# EAGLE schematic final (EAGLE 9.6.2)
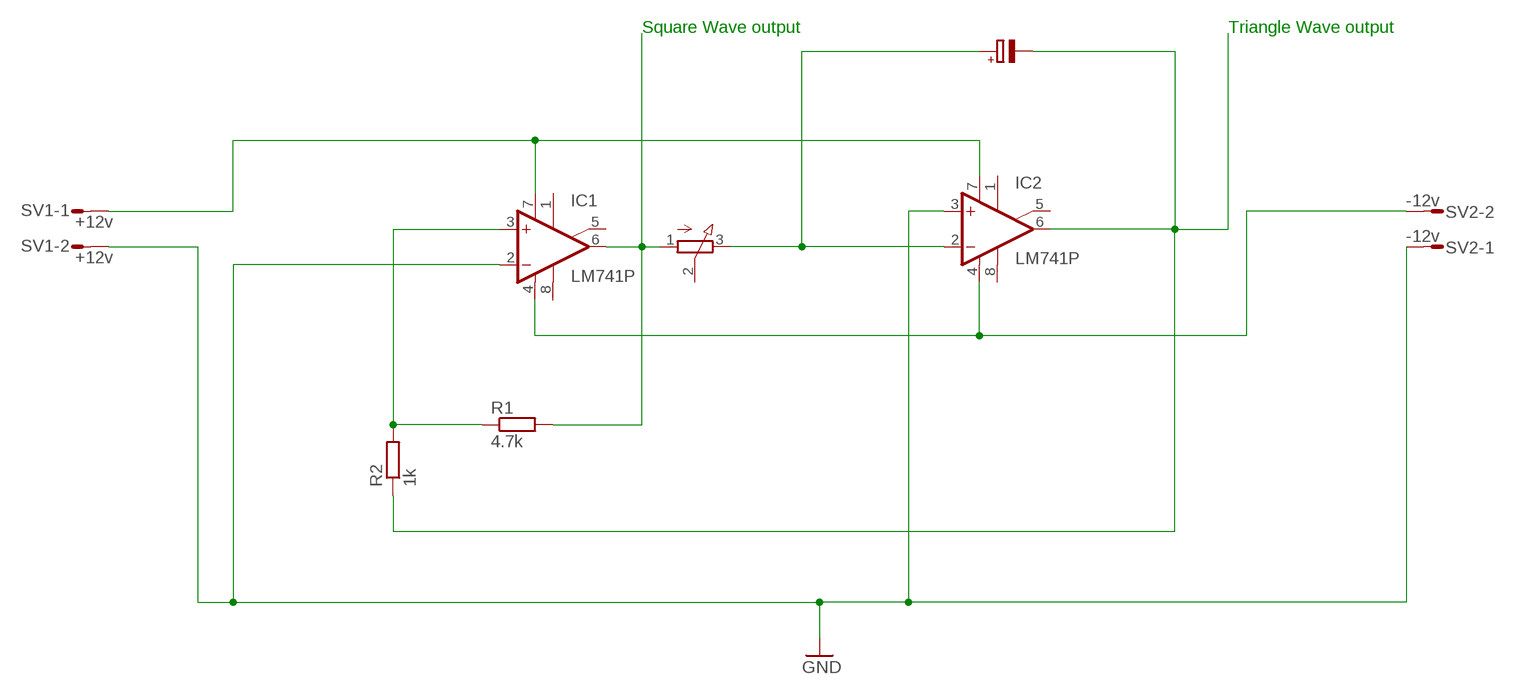
[diagram p0: schematic, sheet 1]

## Parts
C1  0.1u  CPOL-EUE5-6  [E5-6]
IC1  LM741P  [DIL08]
IC2  LM741P  [DIL08]
P1  4.7k--47k  3RP/1610N  [3RP/1610N]
R1  4.7k  R-EU_0613/15  [P0613/15]
R2  1k  R-EU_0613/15  [P0613/15]
SV1  +12v  L02P  [L02P]
SV2  -12v  L02P  [L02P]

## Nets
GND: IC1.2(-IN) IC2.3(+IN) SV1.2 SV2.1
N$1: IC1.7(V+) IC2.7(V+) SV1.1
N$2: C1.+ IC2.2(-IN) P1.3(E)
N$3: C1.- IC2.6(OUT) R2.1
N$4: IC1.3(+IN) R1.1 R2.2
N$5: IC1.6(OUT) P1.1(A) R1.2
N$7: IC1.4(V-) IC2.4(V-) SV2.2
Unconnected: IC1.1(ON1) IC1.5(ON2) IC1.8(OPT) IC2.1(ON1) IC2.5(ON2) IC2.8(OPT) P1.2(S)

## Notes on the sheet
- Square Wave output | Triangle Wave output

## Library data of the parts
C1 = rcl:CPOL-EU: POLARIZED CAPACITOR, European symbol; SPICEPREFIX: C
IC1 IC2 = linear:*741: OP AMP
P1 = pot:3RP/1610N: 16mm Potentiometer one level Source: http://www.alphapotentiometers.net/html/16mm_pot_2.html
R1 R2 = rcl:R-EU_: RESISTOR, European symbol; SPICEPREFIX: R
SV1 SV2 = con-amp-mt:L02P: AMP MT CONNECTOR; OC_FARNELL: unknown; OC_NEWARK: unknown